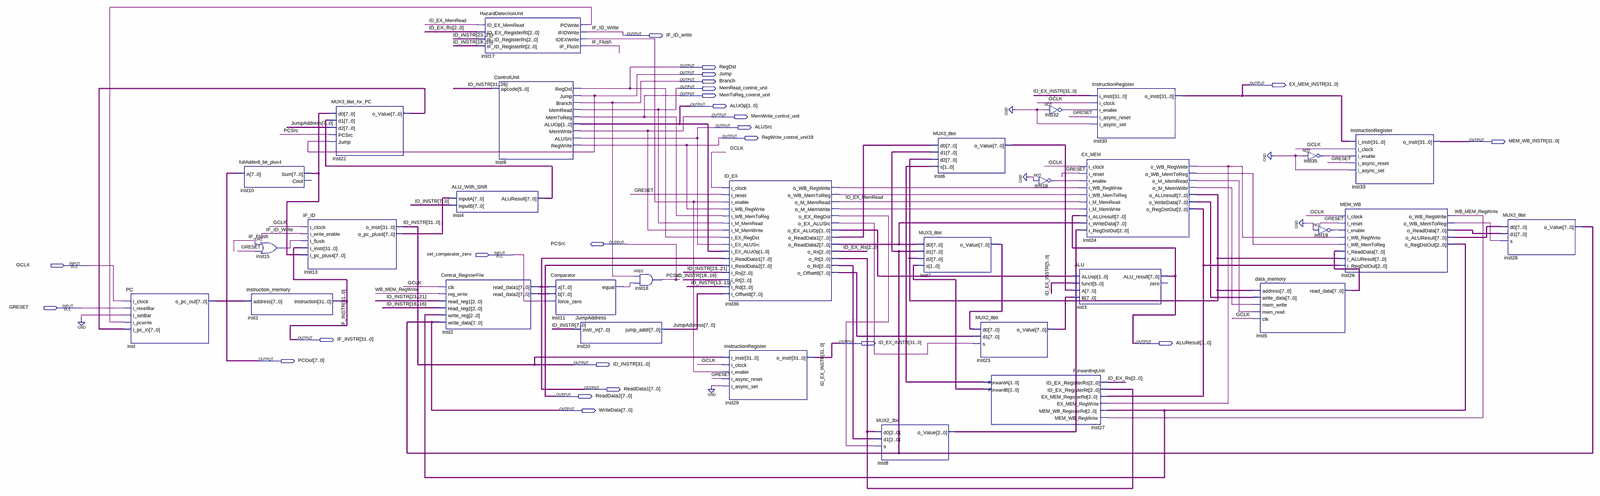
[diagram p0: schematic sheet, whole]
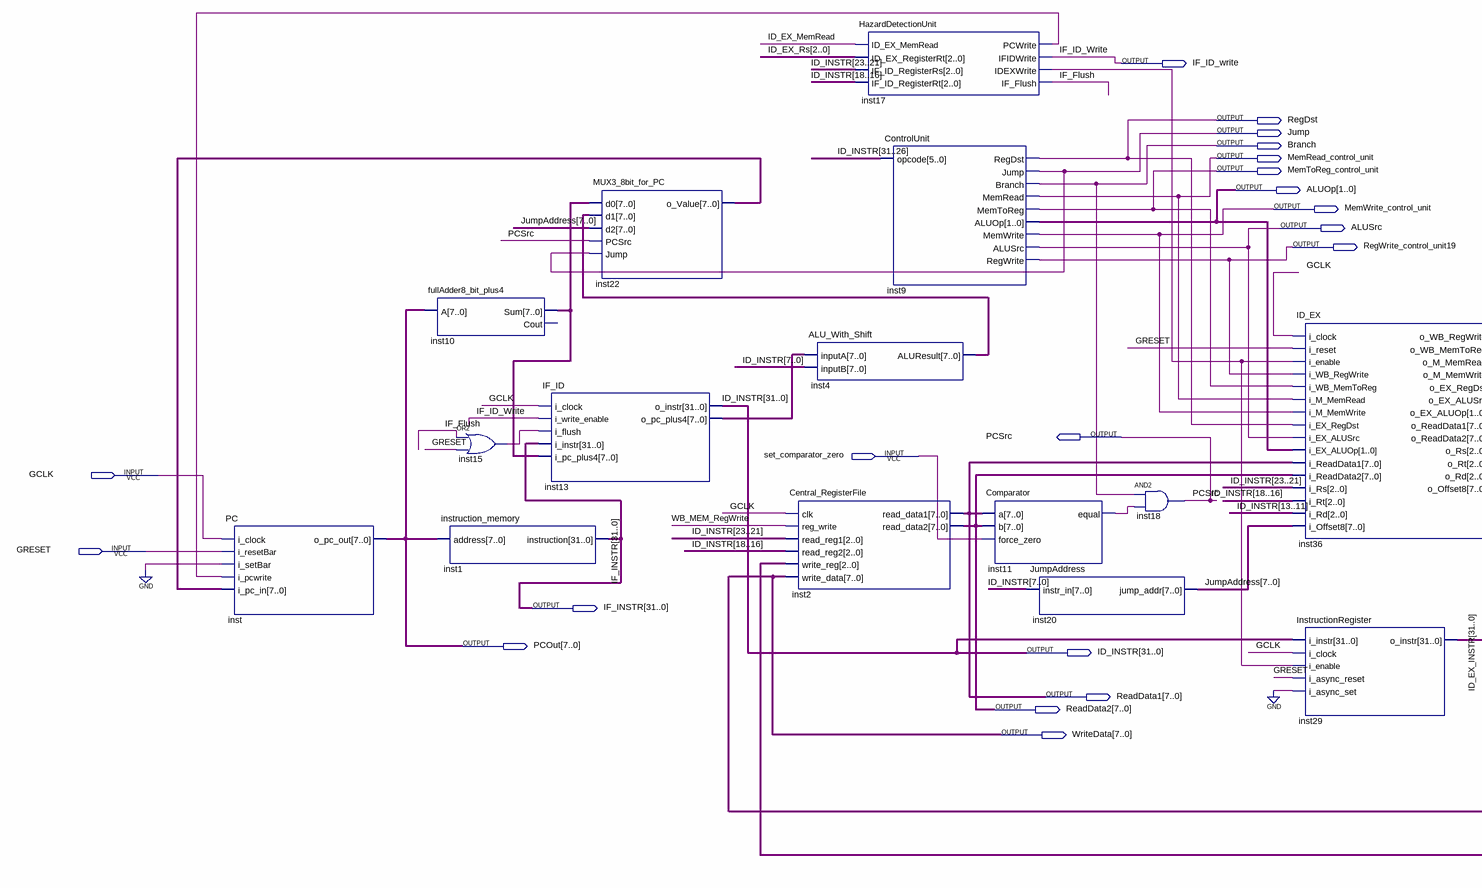
[diagram p1: schematic sheet, left part]
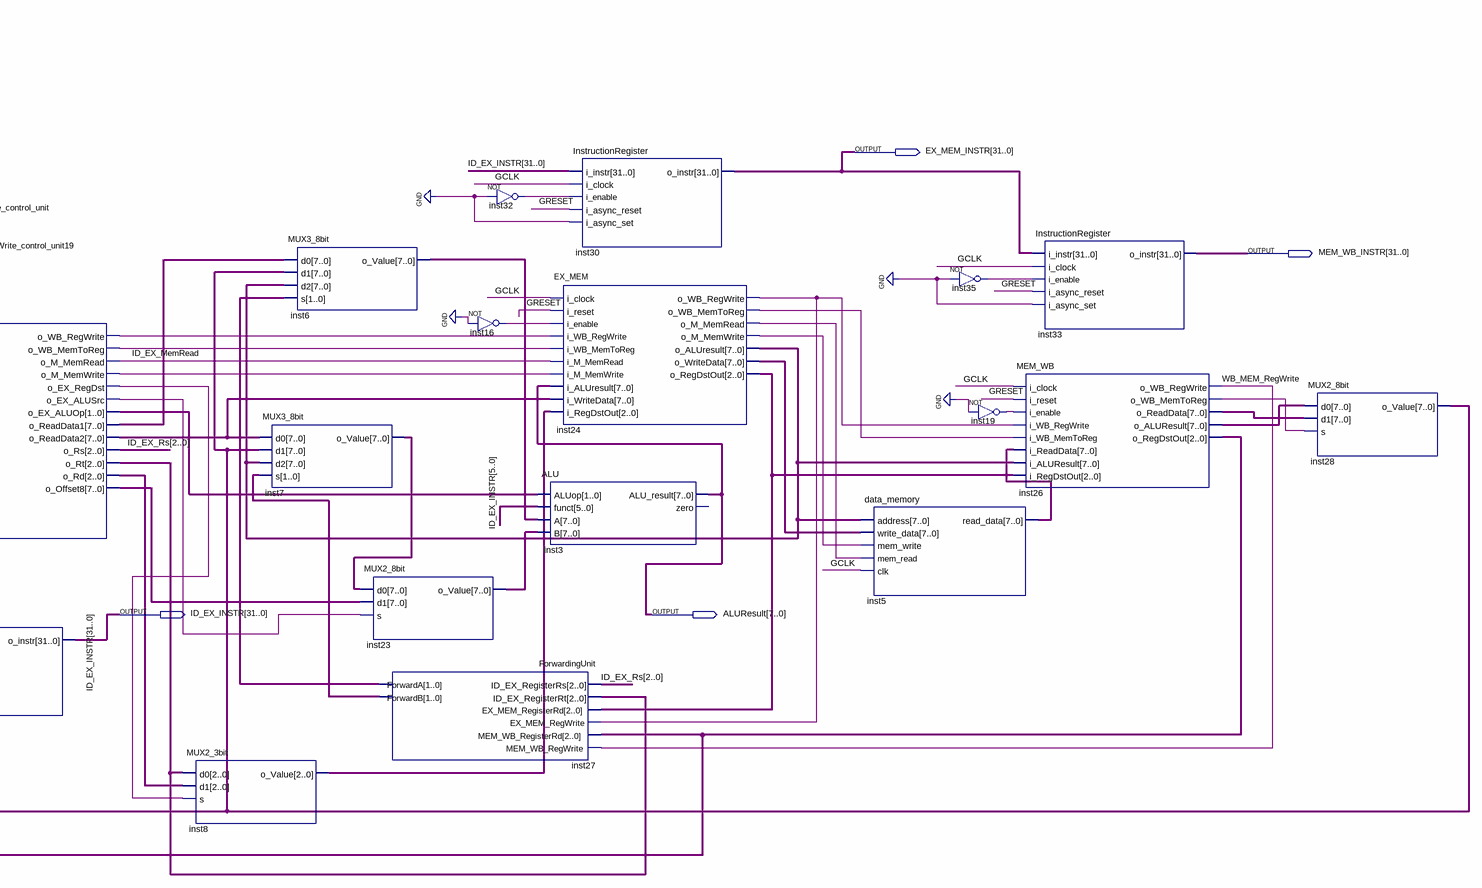
[diagram p2: schematic sheet, right part]
// Quartus schematic pipeline_processor.bdf as structural Verilog: 31 symbols, 24 pins
module pipeline_processor (
  input  set_comparator_zero,
  input  GCLK,
  input  GRESET,
  output IF_ID_write,
  output RegDst,
  output Jump,
  output Branch,
  output [31:0] EX_MEM_INSTR,
  output MemRead_control_unit,
  output MemToReg_control_unit,
  output [1:0] ALUOp,
  output MemWrite_control_unit,
  output ALUSrc,
  output RegWrite_control_unit19,
  output [31:0] MEM_WB_INSTR,
  output PCSrc,
  output [31:0] IF_INSTR,
  output [31:0] ID_EX_INSTR,
  output [7:0] ALUResult,
  output [7:0] PCOut,
  output [31:0] ID_INSTR,
  output [7:0] ReadData1,
  output [7:0] ReadData2,
  output [7:0] WriteData
);

  wire ID_EX_MemRead, IF_Flush, inst11_equal, inst15_out, inst16_out, inst17_idexwrite, inst17_pcwrite,
       inst19_out, inst24_o_m_memread, inst24_o_m_memwrite, inst24_o_wb_memtoreg, inst24_o_wb_regwrite,
       inst26_o_wb_memtoreg, inst32_out, inst35_out, inst36_o_ex_alusrc, inst36_o_ex_regdst,
       inst36_o_m_memwrite, inst36_o_wb_memtoreg, inst36_o_wb_regwrite, WB_MEM_RegWrite;
  wire [1:0] inst27_forwarda, inst27_forwardb, inst36_o_ex_aluop;
  wire [2:0] ID_EX_Rs, inst8_o_value, inst24_o_regdstout, inst26_o_regdstout, inst36_o_rd, inst36_o_rt;
  wire [7:0] inst4_aluresult, inst5_read_data, inst6_o_value, inst7_o_value, inst10_sum, inst13_o_pc_plus4,
       inst22_o_value, inst23_o_value, inst24_o_aluresult, inst24_o_writedata, inst26_o_aluresult,
       inst26_o_readdata, inst36_o_offset8, inst36_o_readdata1, inst36_o_readdata2, JumpAddress;

  PC inst (
    .i_clock(GCLK), .i_resetBar(GRESET), .i_setBar(1'b0), .i_pcwrite(inst17_pcwrite),
    .i_pc_in(inst22_o_value), .o_pc_out(PCOut));
  fullAdder8_bit_plus4 inst10 (.A(PCOut), .Sum(inst10_sum));  // open: Cout
  or inst15 (inst15_out, IF_Flush, GRESET);
  instruction_memory inst1 (.address(PCOut), .instruction(IF_INSTR));
  IF_ID inst13 (
    .i_clock(GCLK), .i_write_enable(IF_ID_write), .i_flush(inst15_out), .i_instr(IF_INSTR),
    .i_pc_plus4(inst10_sum), .o_instr(ID_INSTR), .o_pc_plus4(inst13_o_pc_plus4));
  MUX3_8bit_for_PC inst22 (
    .d0(inst10_sum), .d1(inst4_aluresult), .d2(JumpAddress), .PCSrc(PCSrc), .Jump(Jump),
    .o_Value(inst22_o_value));
  ALU_With_Shift inst4 (.inputA(inst13_o_pc_plus4), .inputB(ID_INSTR[7:0]), .ALUResult(inst4_aluresult));
  Central_RegisterFile inst2 (
    .clk(GCLK), .reg_write(WB_MEM_RegWrite), .read_reg1(ID_INSTR[23:21]), .read_reg2(ID_INSTR[18:16]),
    .write_reg(inst26_o_regdstout), .write_data(WriteData), .read_data1(ReadData1), .read_data2(ReadData2));
  HazardDetectionUnit inst17 (
    .ID_EX_MemRead(ID_EX_MemRead), .ID_EX_RegisterRt(ID_EX_Rs), .IF_ID_RegisterRs(ID_INSTR[23:21]),
    .IF_ID_RegisterRt(ID_INSTR[18:16]), .PCWrite(inst17_pcwrite), .IFIDWrite(IF_ID_write),
    .IDEXWrite(inst17_idexwrite), .IF_Flush(IF_Flush));
  ControlUnit inst9 (
    .opcode(ID_INSTR[31:26]), .RegDst(RegDst), .Jump(Jump), .Branch(Branch), .MemRead(MemRead_control_unit),
    .MemToReg(MemToReg_control_unit), .ALUOp(ALUOp), .MemWrite(MemWrite_control_unit), .ALUSrc(ALUSrc),
    .RegWrite(RegWrite_control_unit19));
  Comparator inst11 (.a(ReadData1), .b(ReadData2), .force_zero(set_comparator_zero), .equal(inst11_equal));
  JumpAddress inst20 (.instr_in(ID_INSTR[7:0]), .jump_addr(JumpAddress));
  and inst18 (PCSrc, Branch, inst11_equal);
  ID_EX inst36 (
    .i_clock(GCLK), .i_reset(GRESET), .i_enable(inst17_idexwrite), .i_WB_RegWrite(RegWrite_control_unit19),
    .i_WB_MemToReg(MemToReg_control_unit), .i_M_MemRead(MemRead_control_unit),
    .i_M_MemWrite(MemWrite_control_unit), .i_EX_RegDst(RegDst), .i_EX_ALUSrc(ALUSrc), .i_EX_ALUOp(ALUOp),
    .i_ReadData1(ReadData1), .i_ReadData2(ReadData2), .i_Rs(ID_INSTR[23:21]), .i_Rt(ID_INSTR[18:16]),
    .i_Rd(ID_INSTR[13:11]), .i_Offset8(JumpAddress), .o_WB_RegWrite(inst36_o_wb_regwrite),
    .o_WB_MemToReg(inst36_o_wb_memtoreg), .o_M_MemRead(ID_EX_MemRead), .o_M_MemWrite(inst36_o_m_memwrite),
    .o_EX_RegDst(inst36_o_ex_regdst), .o_EX_ALUSrc(inst36_o_ex_alusrc), .o_EX_ALUOp(inst36_o_ex_aluop),
    .o_ReadData1(inst36_o_readdata1), .o_ReadData2(inst36_o_readdata2), .o_Rs(ID_EX_Rs), .o_Rt(inst36_o_rt),
    .o_Rd(inst36_o_rd), .o_Offset8(inst36_o_offset8));
  InstructionRegister inst29 (
    .i_instr(ID_INSTR), .i_clock(GCLK), .i_enable(inst17_idexwrite), .i_async_reset(GRESET),
    .i_async_set(1'b0), .o_instr(ID_EX_INSTR));
  MUX2_3bit inst8 (.d0(inst36_o_rt), .d1(inst36_o_rd), .s(inst36_o_ex_regdst), .o_Value(inst8_o_value));
  MUX3_8bit inst6 (
    .d0(inst36_o_readdata1), .d1(WriteData), .d2(inst24_o_aluresult), .s(inst27_forwarda),
    .o_Value(inst6_o_value));
  MUX3_8bit inst7 (
    .d0(inst36_o_readdata2), .d1(WriteData), .d2(inst24_o_aluresult), .s(inst27_forwardb),
    .o_Value(inst7_o_value));
  MUX2_8bit inst23 (.d0(inst7_o_value), .d1(inst36_o_offset8), .s(inst36_o_ex_alusrc), .o_Value(inst23_o_value));
  ForwardingUnit inst27 (
    .ID_EX_RegisterRs(ID_EX_Rs), .ID_EX_RegisterRt(inst36_o_rt), .EX_MEM_RegisterRd(inst24_o_regdstout),
    .EX_MEM_RegWrite(inst24_o_wb_regwrite), .MEM_WB_RegisterRd(inst26_o_regdstout),
    .MEM_WB_RegWrite(WB_MEM_RegWrite), .ForwardA(inst27_forwarda), .ForwardB(inst27_forwardb));
  not inst32 (inst32_out, 1'b0);
  not inst16 (inst16_out, 1'b0);
  EX_MEM inst24 (
    .i_clock(GCLK), .i_reset(GRESET), .i_enable(inst16_out), .i_WB_RegWrite(inst36_o_wb_regwrite),
    .i_WB_MemToReg(inst36_o_wb_memtoreg), .i_M_MemRead(ID_EX_MemRead), .i_M_MemWrite(inst36_o_m_memwrite),
    .i_ALUresult(ALUResult), .i_WriteData(inst36_o_readdata2), .i_RegDstOut(inst8_o_value),
    .o_WB_RegWrite(inst24_o_wb_regwrite), .o_WB_MemToReg(inst24_o_wb_memtoreg),
    .o_M_MemRead(inst24_o_m_memread), .o_M_MemWrite(inst24_o_m_memwrite), .o_ALUresult(inst24_o_aluresult),
    .o_WriteData(inst24_o_writedata), .o_RegDstOut(inst24_o_regdstout));
  ALU inst3 (
    .ALUop(inst36_o_ex_aluop), .funct(ID_EX_INSTR[5:0]), .A(inst6_o_value), .B(inst23_o_value),
    .ALU_result(ALUResult));  // open: zero
  InstructionRegister inst30 (
    .i_instr(ID_EX_INSTR), .i_clock(GCLK), .i_enable(inst32_out), .i_async_reset(GRESET), .i_async_set(1'b0),
    .o_instr(EX_MEM_INSTR));
  data_memory inst5 (
    .address(inst24_o_aluresult), .write_data(inst24_o_writedata), .mem_write(inst24_o_m_memwrite),
    .mem_read(inst24_o_m_memread), .clk(GCLK), .read_data(inst5_read_data));
  not inst35 (inst35_out, 1'b0);
  not inst19 (inst19_out, 1'b0);
  InstructionRegister inst33 (
    .i_instr(EX_MEM_INSTR), .i_clock(GCLK), .i_enable(inst35_out), .i_async_reset(GRESET),
    .i_async_set(1'b0), .o_instr(MEM_WB_INSTR));
  MEM_WB inst26 (
    .i_clock(GCLK), .i_reset(GRESET), .i_enable(inst19_out), .i_WB_RegWrite(inst24_o_wb_regwrite),
    .i_WB_MemToReg(inst24_o_wb_memtoreg), .i_ReadData(inst5_read_data), .i_ALUResult(inst24_o_aluresult),
    .i_RegDstOut(inst24_o_regdstout), .o_WB_RegWrite(WB_MEM_RegWrite), .o_WB_MemToReg(inst26_o_wb_memtoreg),
    .o_ReadData(inst26_o_readdata), .o_ALUResult(inst26_o_aluresult), .o_RegDstOut(inst26_o_regdstout));
  MUX2_8bit inst28 (.d0(inst26_o_aluresult), .d1(inst26_o_readdata), .s(inst26_o_wb_memtoreg), .o_Value(WriteData));
endmodule
